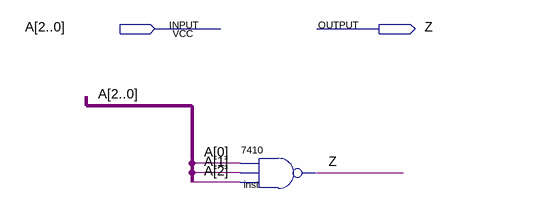
[diagram p0: schematic sheet]
// Quartus schematic nand_3in.bdf as structural Verilog: 1 symbols, 2 pins
module nand_3in (
  input  [2:0] A,
  output Z
);

  \7410  inst (.\2 (A[0]), .\3 (A[1]), .\4 (A[2]), .\1 (Z));
endmodule
